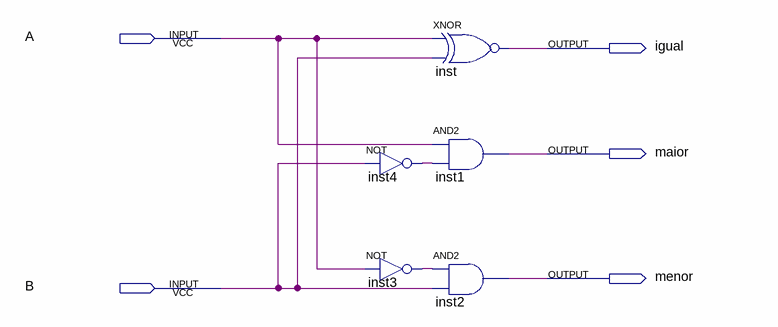
[diagram p0: schematic sheet]
// Quartus schematic comparar1bit.bdf as structural Verilog: 5 symbols, 5 pins
module comparar1bit (
  input  A,
  input  B,
  output igual,
  output maior,
  output menor
);

  wire inst3_out, inst4_out;

  not inst4 (inst4_out, B);
  not inst3 (inst3_out, A);
  xnor inst (igual, A, B);
  and inst1 (maior, A, inst4_out);
  and inst2 (menor, inst3_out, B);
endmodule
